# EAGLE schematic control_wiring (EAGLE 6.5.0)
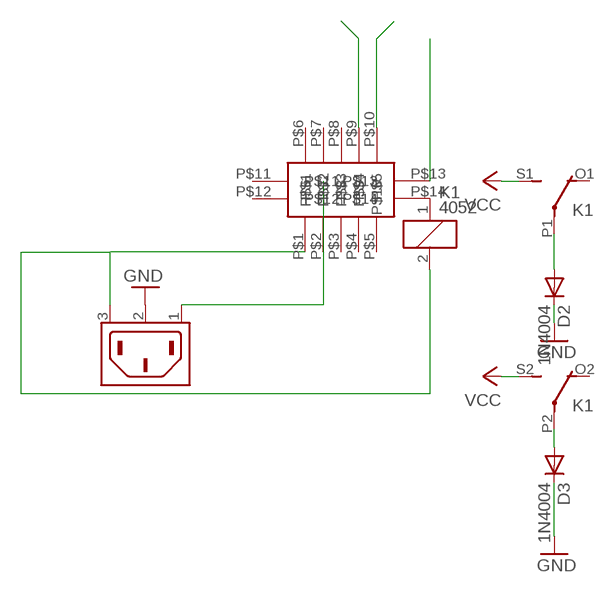
[diagram p0: schematic, sheet 1]

## Parts
D2  1N4004  [DO41-10]
D3  1N4004  [DO41-10]
K1  4052  [F4052]
U$1  SYL-2362  [SYL-2362]
X1  6ESRM-P  [6ESRM-P]

## Nets
GND: D2.C D3.C X1.2(SH)
L: U$1.P$2 U$1.P$13 X1.1(AC1)
N: K1.2 U$1.P$1 X1.3(AC2)
N$2: K1.1 U$1.P$14
N$3: D3.A K1.P2(3:P)
N$4: D2.A K1.P1(2:P)
TC+: U$1.P$9
TC-: U$1.P$10
VCC: K1.S1(2:S) K1.S2(3:S)
Unconnected: K1.O1(2:O) K1.O2(3:O) U$1.P$3 U$1.P$4 U$1.P$5 U$1.P$6 U$1.P$7 U$1.P$8 U$1.P$11 U$1.P$12

## Library data of the parts
D2 D3 = diode:1N4004: DIODE general purpose rectifier, 1 A
K1 = relay:4052: RELAY 2 x switch, Finder; OC_FARNELL: unknown; OC_NEWARK: unknown
U$1 = auber:SYL-2362
X1 = con-tycoelectronics:6ESRM-P: AC Connector 120/250 VAC Source: http://catalog.tycoelectronics.com .. ENG_DS_1654001_1099_SR_0406.pdf; MF: TYCO ELECTRONICS; MPN: 6ESRM-P; OC_FARNELL: unknown; OC_NEWARK: 87F1821